# Altium schematic sheet Structure.SchDoc
size A4; Organization: Test; Address1: L3, 12a Rodborough Rd; Address2: Frenchs Forest; Address3: NSW; Address4: Australia 2086
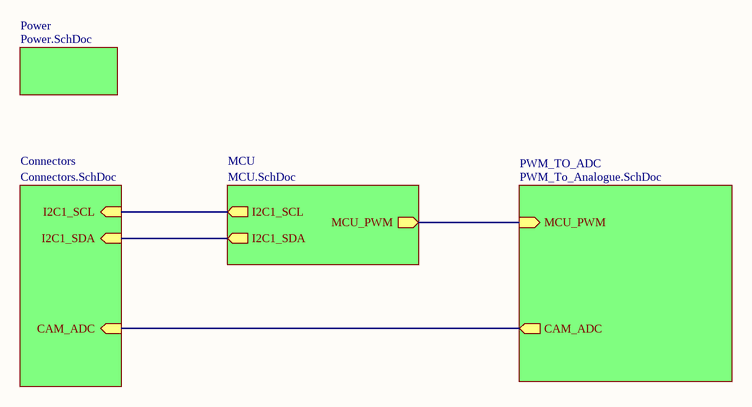
[diagram p0: Structure.SchDoc]

## Sub-sheets
Connectors = Connectors.SchDoc: I2C1_SCL (in), I2C1_SDA (in), CAM_ADC (in)
MCU = MCU.SchDoc: I2C1_SCL (out), I2C1_SDA (out), MCU_PWM (out)
Power = Power.SchDoc: no entries
PWM_TO_ADC = PWM_To_Analogue.SchDoc: MCU_PWM (in), CAM_ADC (out)

## Nets
(unnamed): sheet Connectors/I2C1_SCL, sheet MCU/I2C1_SCL
(unnamed): sheet Connectors/I2C1_SDA, sheet MCU/I2C1_SDA
(unnamed): sheet Connectors/CAM_ADC, sheet PWM_TO_ADC/CAM_ADC
(unnamed): sheet MCU/MCU_PWM, sheet PWM_TO_ADC/MCU_PWM

## Notes on the sheet
- Title
- Size:
- Date:
- A4
- Number:
- Time:
- Revision:
- Sheet
- of
- File: